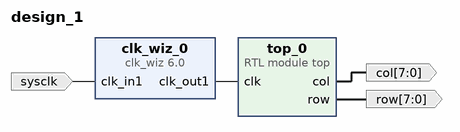
[diagram p0: block diagram of the top level]
# Vivado block design design_1, xc7z020clg400-1, Vivado 2023.2
create_bd_design design_1

create_bd_port -dir I -type clk sysclk
set_property -dict {CONFIG.FREQ_HZ 20000000} [get_bd_ports sysclk]
create_bd_port -dir O -from 7 -to 0 row
create_bd_port -dir O -from 7 -to 0 col

create_bd_cell -type ip -vlnv xilinx.com:ip:clk_wiz:6.0 clk_wiz_0
set_property -dict [list \
  CONFIG.CLKIN1_JITTER_PS 500.0 \
  CONFIG.CLKOUT1_JITTER 353.847 \
  CONFIG.CLKOUT1_PHASE_ERROR 301.005 \
  CONFIG.CLKOUT1_REQUESTED_OUT_FREQ 25.000 \
  CONFIG.MMCM_CLKFBOUT_MULT_F 50.000 \
  CONFIG.MMCM_CLKIN1_PERIOD 50.000 \
  CONFIG.MMCM_CLKIN2_PERIOD 10.0 \
  CONFIG.MMCM_CLKOUT0_DIVIDE_F 40.000 \
  CONFIG.PRIM_IN_FREQ 20.000 \
] [get_bd_cells clk_wiz_0]
create_bd_cell -type module -reference top top_0

# ---- connections ----

connect_bd_net -net clk_in1_0_1 [get_bd_ports sysclk] [get_bd_pins clk_wiz_0/clk_in1]
connect_bd_net [get_bd_pins clk_wiz_0/clk_out1] [get_bd_pins top_0/clk]
connect_bd_net [get_bd_pins top_0/col] [get_bd_ports col]
connect_bd_net [get_bd_pins top_0/row] [get_bd_ports row]

validate_bd_design
save_bd_design
